# EAGLE design swimate (EAGLE 6.5.0)
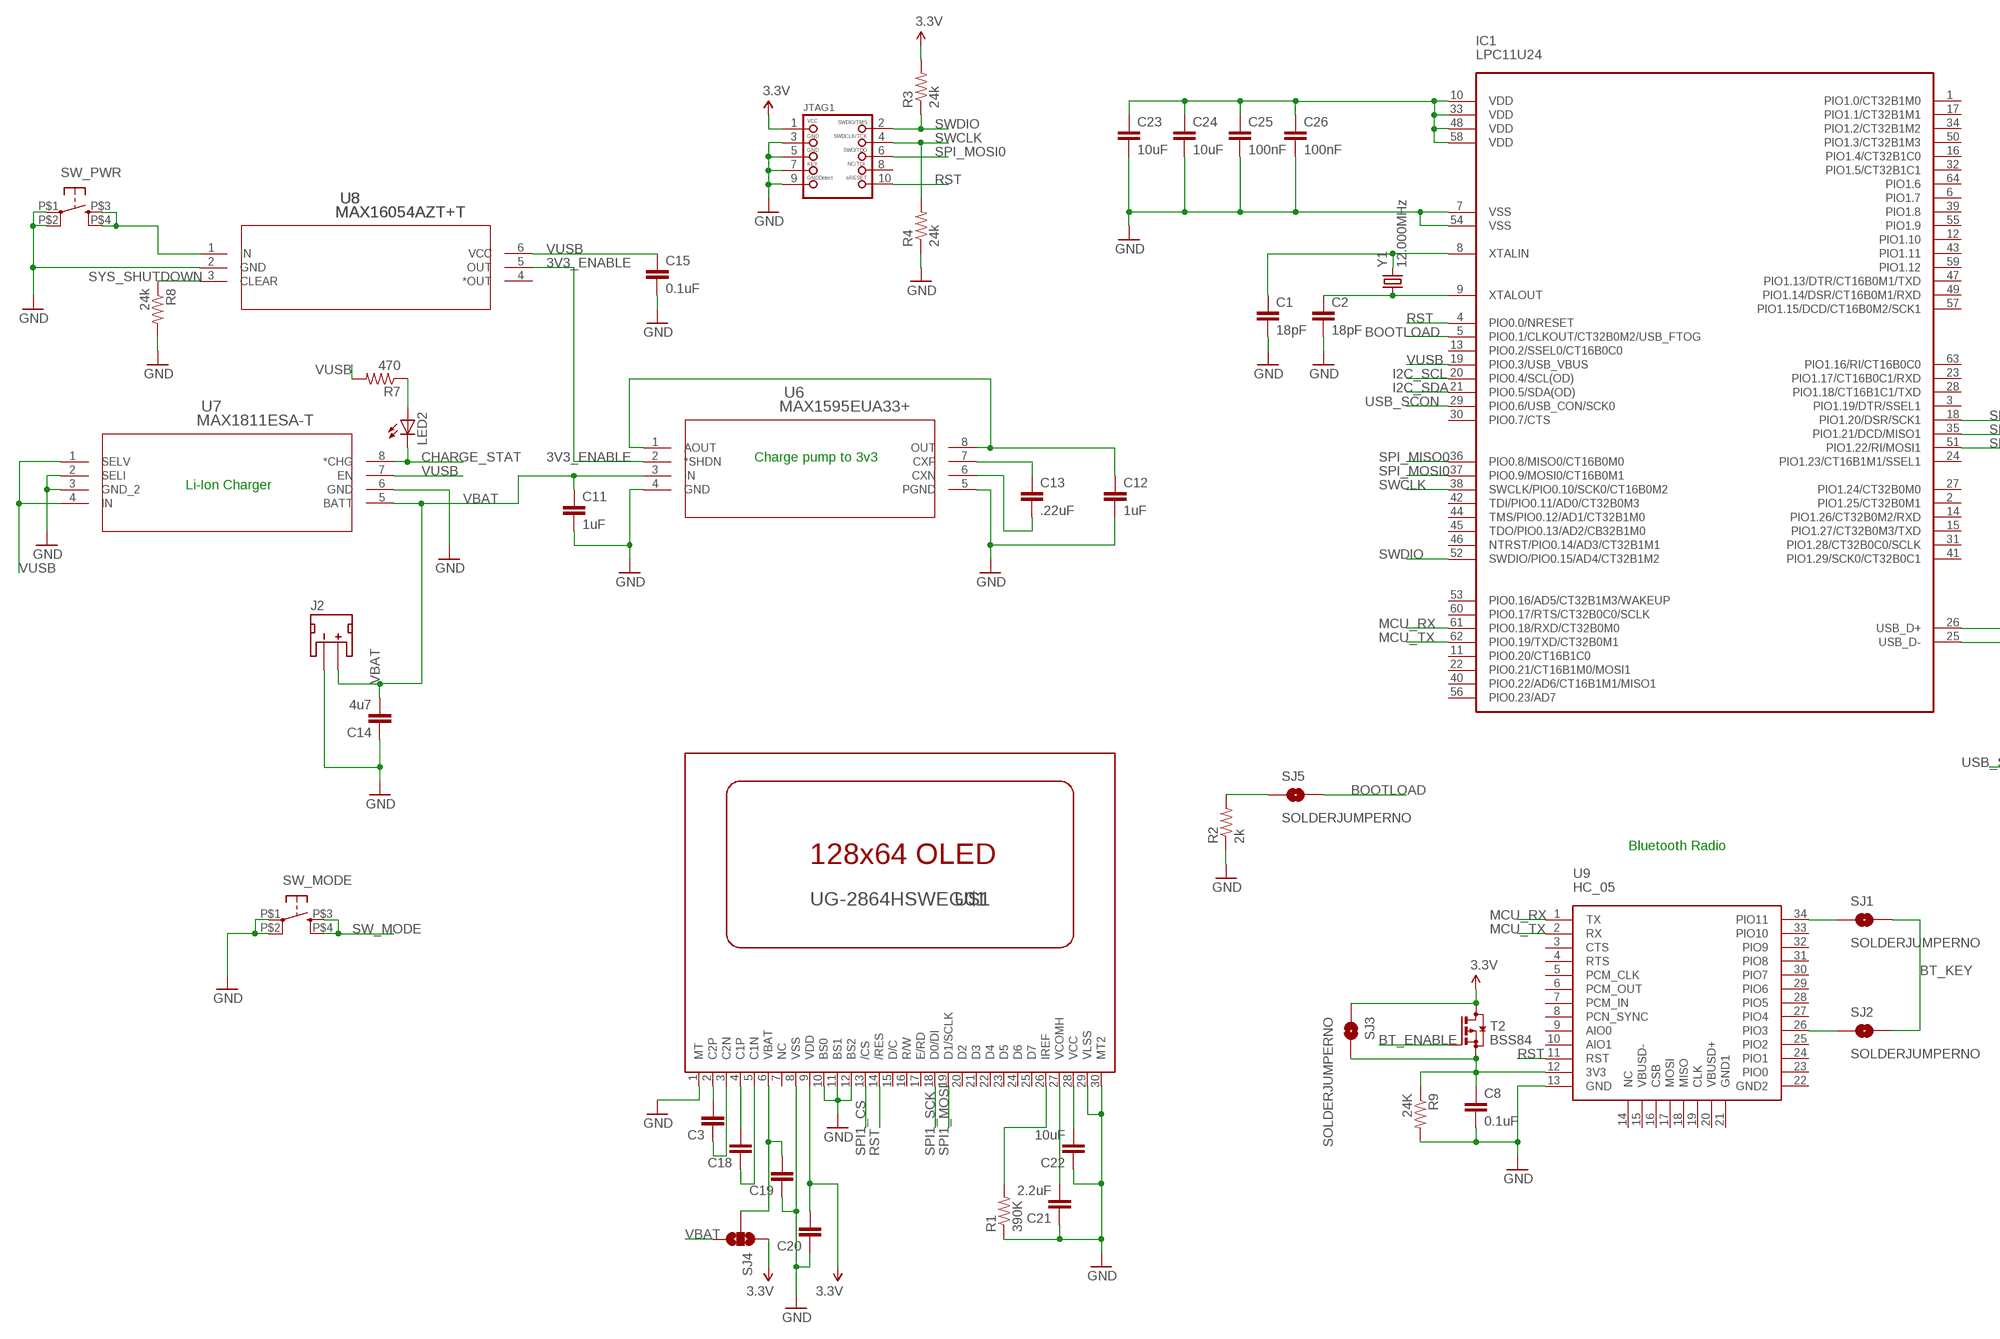
[diagram p0: schematic, sheet 1, part 1 of 2]
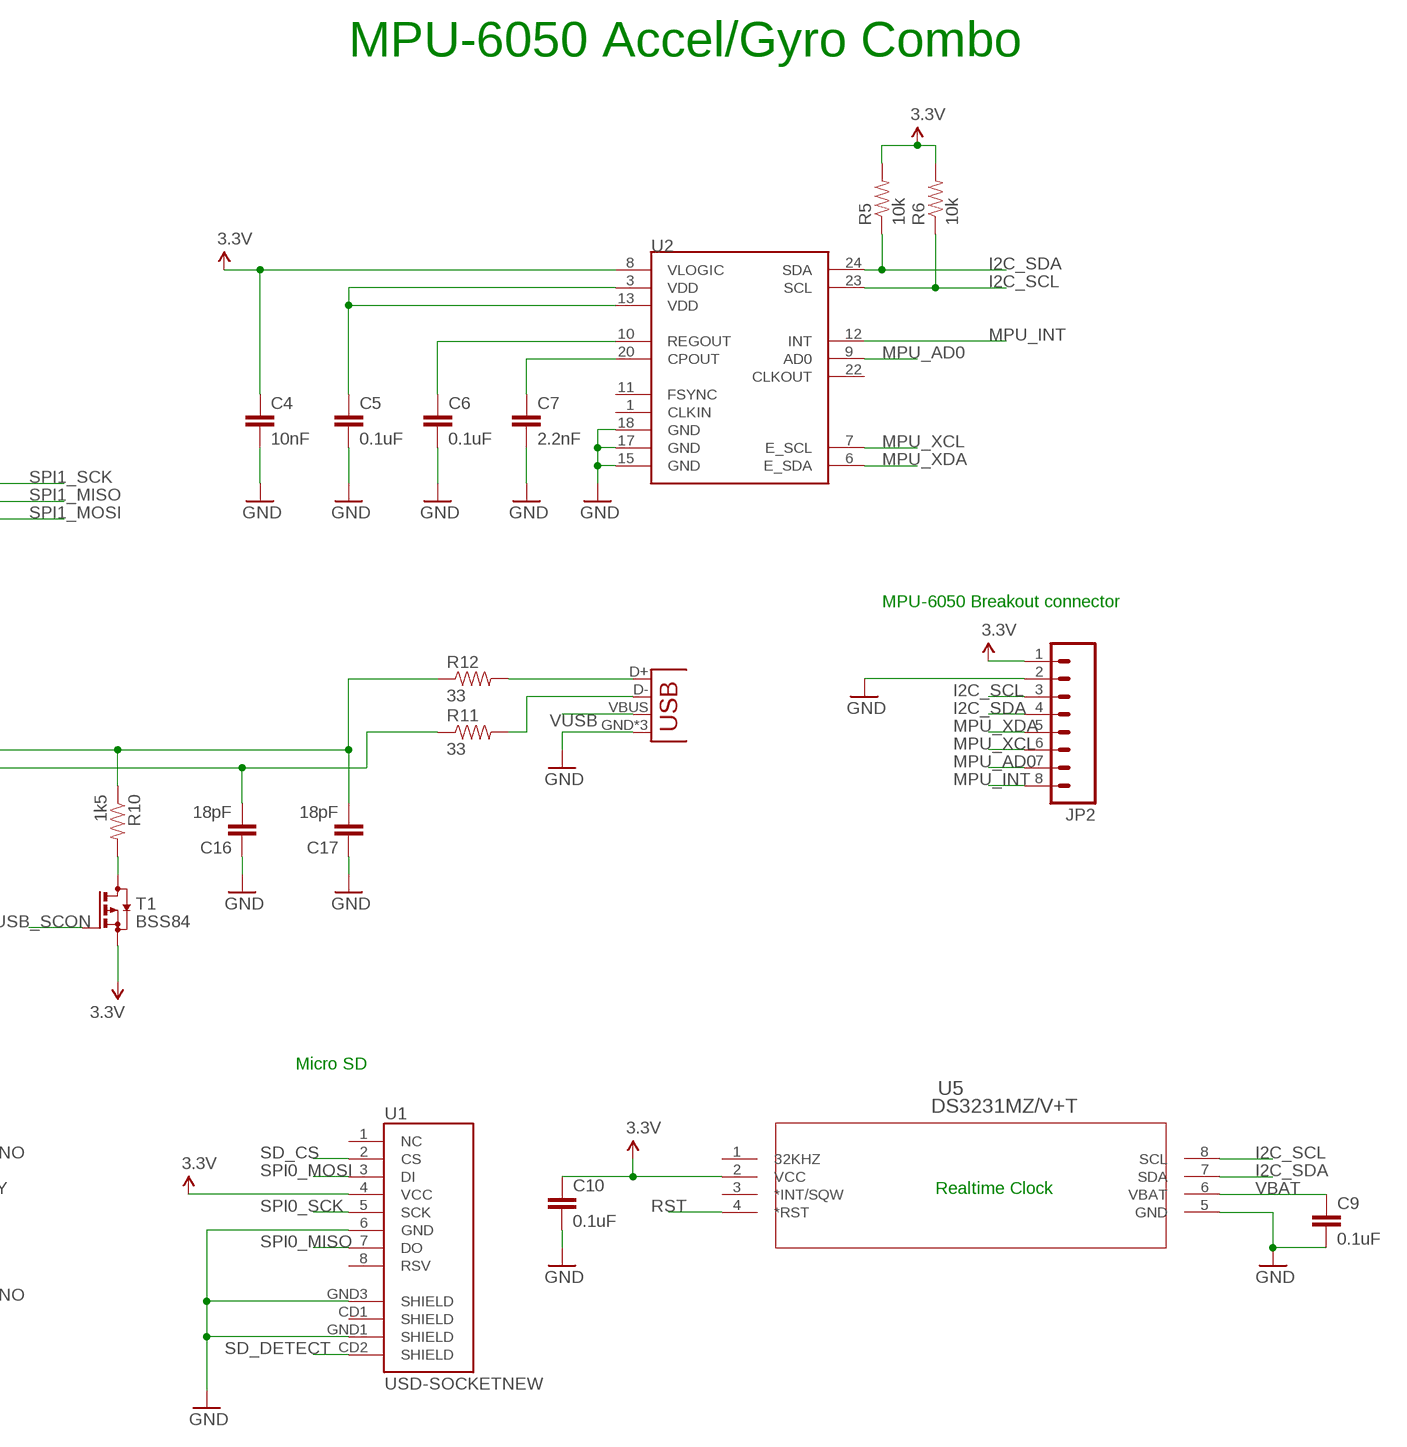
[diagram p1: schematic, sheet 1, part 2 of 2]

## Parts
C1  18pF  CAP0805  [0805]
C2  18pF  CAP0805  [0805]
C3  CAP0805  [0805]
C4  10nF  CAP0805  [0805]
C5  0.1uF  CAP0805  [0805]
C6  0.1uF  CAP0805  [0805]
C7  2.2nF  CAP0805  [0805]
C8  0.1uF  CAP0805  [0805]
C9  0.1uF  CAP0805  [0805]
C10  0.1uF  CAP0805  [0805]
C11  1uF  CAP1206  [1206]
C12  1uF  CAP1206  [1206]
C13  .22uF  CAP0805  [0805]
C14  4u7  CAP1206  [1206]
C15  0.1uF  CAP0805  [0805]
C16  18pF  CAP0805  [0805]
C17  18pF  CAP0805  [0805]
C18  CAP0805  [0805]
C19  CAP0805  [0805]
C20  CAP0805  [0805]
C21  2.2uF  CAP0805  [0805]
C22  10uF  CAP0805  [0805]
C23  10uF  CAP0805  [0805]
C24  10uF  CAP0805  [0805]
C25  100nF  CAP0805  [0805]
C26  100nF  CAP0805  [0805]
IC1  LPC11U24  [MBED-ICS_LQFP64]
J2  JST_2MM_MALE  [JST-2-SMD]
JP2  M08  [1X08_PIN1_NO_SILK]
JP3  USB-MICROB  [USB-MICROB]
JTAG1  JTAG-CORTEXM3  [2X05_1.27MM_SMT]
LED2  LED1206  [LED-1206]
R1  390K  RESISTOR0805-RES  [0805]
R2  2k  RESISTOR0805-RES  [0805]
R3  24k  RESISTOR0805-RES  [0805]
R4  24k  RESISTOR0805-RES  [0805]
R5  10k  RESISTOR0805-RES  [0805]
R6  10k  RESISTOR0805-RES  [0805]
R7  470  RESISTOR0805-RES  [0805]
R8  24k  RESISTOR0805-RES  [0805]
R9  24K  RESISTOR0805-RES  [0805]
R10  1k5  RESISTOR0805-RES  [0805]
R11  33  RESISTOR0805-RES  [0805]
R12  33  RESISTOR0805-RES  [0805]
SJ1  SOLDERJUMPERNO  [SJ_2S-NO]
SJ2  SOLDERJUMPERNO  [SJ_2S-NO]
SJ3  SOLDERJUMPERNO  [SJ_2S-NO]
SJ4  SOLDERJUMPER_2WAYS  [SJ_3]
SJ5  SOLDERJUMPERNO  [SJ_2S-NO]
SW_MODE  TAC_SWITCHKSA_SEALED  [KSA_SEALED_TAC_SWITCH]
SW_PWR  TAC_SWITCHKSA_SEALED  [KSA_SEALED_TAC_SWITCH]
T1  BSS84  [SOT23]
T2  BSS84  [SOT23]
U1  USD-SOCKETNEW  [MICRO-SD-SOCKET-PP]
U2  MPU-9150QFN-24-NP  [QFN-24-NP]
U5  DS3231MZ/V+T  [21-0041B_8]
U6  MAX1595EUA33+  [21-0036K]
U7  MAX1811ESA-T  [21-0041B_8]
U8  MAX16054AZT+T  [21-0114C]
U9  HC_05  [BLUETOOTH_SMD]
U$1  UG-2864HSWEG01  [1X30-0.7MM]
Y1  12.000MHz  CRYSTAL5X3  [CRYSTAL-SMD-5X3]

## Nets
3.3V: C4.1 C10.1 C20.2 JP2.1 JTAG1.1 R3.2 R5.2 R6.2 SJ3.1 SJ4.1 T1.2(S) T2.3(D) U1.4(VCC) U2.8(VLOGIC) U5.2(VCC) U$1.9(VDD)
3V3_ENABLE: U6.2(*SHDN) U8.5(OUT)
BOOTLOAD: IC1.5(PIO0.1/CLKOUT/CT32B0M2/USB_FTOG) SJ5.2
BT_ENABLE: T2.1(G)
BT_KEY: SJ1.2 SJ2.2
CHARGE_STAT: LED2.C U7.8(*CHG)
GND: C1.2 C2.2 C4.2 C5.2 C6.2 C7.2 C8.2 C9.2 C10.2 C11.2 C12.2 C14.1 C15.2 C16.1 C17.1 C19.1 C20.1 C21.1 C22.1 C23.2 C24.2 C25.2 C26.2 IC1.7(VSS) IC1.54(VSS) J2.1(-) JP2.2 JP3.GND JP3.MT1(GND) JP3.MT2(GND) JTAG1.3 JTAG1.5 JTAG1.7 JTAG1.9 R1.1 R2.1 R4.1 R8.2 R9.2 SW_MODE.P$1 SW_MODE.P$2 SW_PWR.P$1 SW_PWR.P$2 U1.6(GND) U1.GND1(SHIELD) U1.GND3(SHIELD) U2.15(GND) U2.17(GND) U2.18(GND) U5.5(GND) U6.4(GND) U6.5(PGND) U7.2(SELI) U7.3(GND_2) U7.6(GND) U8.2(GND) U9.13(GND) U$1.1(MT) U$1.8(VSS) U$1.10(BS0) U$1.11(BS1) U$1.12(BS2) U$1.29(VLSS) U$1.30(MT2)
I2C_SCL: IC1.20(PIO0.4/SCL(OD)) JP2.3 R6.1 U2.23(SCL) U5.8(SCL)
I2C_SDA: IC1.21(PIO0.5/SDA(OD)) JP2.4 R5.1 U2.24(SDA) U5.7(SDA)
MCU_RX: IC1.61(PIO0.18/RXD/CT32B0M0) U9.1(TX)
MCU_TX: IC1.62(PIO0.19/TXD/CT32B0M1) U9.2(RX)
MPU_AD0: JP2.7 U2.9(AD0)
MPU_INT: JP2.8 U2.12(INT)
MPU_XCL: JP2.6 U2.7(E_SCL)
MPU_XDA: JP2.5 U2.6(E_SDA)
N$1: SW_PWR.P$3 SW_PWR.P$4 U8.1(IN)
N$2: C18.1 U$1.5(C1N)
N$3: R1.2 U$1.26(IREF)
N$4: C5.1 U2.3(VDD) U2.13(VDD)
N$5: C6.1 U2.10(REGOUT)
N$6: C23.1 C24.1 C25.1 C26.1 IC1.10(VDD) IC1.33(VDD) IC1.48(VDD) IC1.58(VDD)
N$7: C7.1 U2.20(CPOUT)
N$8: LED2.A R7.1
N$9: SJ2.1 U9.26(PIO3)
N$11: SJ1.1 U9.34(PIO11)
N$12: C12.1 U6.1(AOUT) U6.8(OUT)
N$13: C13.1 U6.7(CXP)
N$14: C13.2 U6.6(CXN)
N$15: C8.1 R9.1 SJ3.2 T2.2(S) U9.12(3V3)
N$16: R10.2 T1.3(D)
N$17: C17.2 IC1.26(USB_D+) R10.1 R12.1
N$18: C16.2 IC1.25(USB_D-) R11.1
N$19: JP3.D+ R12.2
N$20: JP3.D- R11.2
N$21: R2.2 SJ5.1
N$23: C1.1 IC1.8(XTALIN) Y1.3
N$24: C2.1 IC1.9(XTALOUT) Y1.1
N$25: C3.2 U$1.2(C2P)
N$26: C22.2 U$1.28(VCC)
N$27: C3.1 U$1.3(C2N)
N$28: C21.2 U$1.27(VCOMH)
N$29: C18.2 U$1.4(C1P)
RST: IC1.4(PIO0.0/NRESET) JTAG1.10 U5.4(*RST) U9.11(RST) U$1.14(/RES)
SD_CS: U1.2(CS)
SD_DETECT: U1.CD2(SHIELD)
SPI0_MISO: U1.7(DO)
SPI0_MOSI: U1.3(DI)
SPI0_SCK: U1.5(SCK)
SPI1_CS: U$1.13(/CS)
SPI1_MISO: IC1.35(PIO1.21/DCD/MISO1)
SPI1_MOSI: IC1.51(PIO1.22/RI/MOSI1) U$1.19(D1/SCLK)
SPI1_SCK: IC1.18(PIO1.20/DSR/SCK1) U$1.18(D0/DI)
SPI_MISO0: IC1.36(PIO0.8/MISO0/CT16B0M0)
SPI_MOSI0: IC1.37(PIO0.9/MOSI0/CT16B0M1) JTAG1.6
SW_MODE: SW_MODE.P$3 SW_MODE.P$4
SWCLK: IC1.38(SWCLK/PIO0.10/SCK0/CT16B0M2) JTAG1.4 R4.2
SWDIO: IC1.52(SWDIO/PIO0.15/AD4/CT32B1M2) JTAG1.2 R3.1
SYS_SHUTDOWN: R8.1 U8.3(CLEAR)
USB_SCON: IC1.29(PIO0.6/USB_CON/SCK0) T1.1(G)
VBAT: C9.1 C11.1 C14.2 J2.2(+) SJ4.3 U5.6(VBAT) U6.3(IN) U7.5(BATT)
VDISPLAY: C19.2 SJ4.2 U$1.6(VBAT)
VUSB: C15.1 IC1.19(PIO0.3/USB_VBUS) JP3.VBUS R7.2 U7.1(SELV) U7.4(IN) U7.7(EN) U8.6(VCC)
Unconnected: IC1.1(PIO1.0/CT32B1M0) IC1.2(PIO1.25/CT32B0M1) IC1.3(PIO1.19/DTR/SSEL1) IC1.6(PIO1.7) IC1.11(PIO0.20/CT16B1C0) IC1.12(PIO1.10) IC1.13(PIO0.2/SSEL0/CT16B0C0) IC1.14(PIO1.26/CT32B0M2/RXD) IC1.15(PIO1.27/CT32B0M3/TXD) IC1.16(PIO1.4/CT32B1C0) IC1.17(PIO1.1/CT32B1M1) IC1.22(PIO0.21/CT16B1M0/MOSI1) IC1.23(PIO1.17/CT16B0C1/RXD) IC1.24(PIO1.23/CT16B1M1/SSEL1) IC1.27(PIO1.24/CT32B0M0) IC1.28(PIO1.18/CT16B1C1/TXD) IC1.30(PIO0.7/CTS) IC1.31(PIO1.28/CT32B0C0/SCLK) IC1.32(PIO1.5/CT32B1C1) IC1.34(PIO1.2/CT32B1M2) IC1.39(PIO1.8) IC1.40(PIO0.22/AD6/CT16B1M1/MISO1) IC1.41(PIO1.29/SCK0/CT32B0C1) IC1.42(TDI/PIO0.11/AD0/CT32B0M3) IC1.43(PIO1.11) IC1.44(TMS/PIO0.12/AD1/CT32B1M0) IC1.45(TDO/PIO0.13/AD2/CB32B1M0) IC1.46(NTRST/PIO0.14/AD3/CT32B1M1) IC1.47(PIO1.13/DTR/CT16B0M1/TXD) IC1.49(PIO1.14/DSR/CT16B0M1/RXD) IC1.50(PIO1.3/CT32B1M3) IC1.53(PIO0.16/AD5/CT32B1M3/WAKEUP) IC1.55(PIO1.9) IC1.56(PIO0.23/AD7) IC1.57(PIO1.15/DCD/CT16B0M2/SCK1) IC1.59(PIO1.12) IC1.60(PIO0.17/RTS/CT32B0C0/SCLK) IC1.63(PIO1.16/RI/CT16B0C0) IC1.64(PIO1.6) J2.NC1(PAD1) J2.NC2(PAD2) JTAG1.8 U1.1(NC) U1.8(RSV) U1.CD1(SHIELD) U2.1(CLKIN) U2.11(FSYNC) U2.22(CLKOUT) U5.1(32KHZ) U5.3(*INT/SQW) U8.4(*OUT) U9.3(CTS) U9.4(RTS) U9.5(PCM_CLK) U9.6(PCM_OUT) U9.7(PCM_IN) U9.8(PCN_SYNC) U9.9(AIO0) U9.10(AIO1) U9.14(NC) U9.15(VBUSD-) U9.16(CSB) U9.17(MOSI) U9.18(MISO) U9.19(CLK) U9.20(VBUSD+) U9.21(GND1) U9.22(GND2) U9.23(PIO0) U9.24(PIO1) U9.25(PIO2) U9.27(PIO4) U9.28(PIO5) U9.29(PIO6) U9.30(PIO7) U9.31(PIO8) U9.32(PIO9) U9.33(PIO10) U$1.7(NC) U$1.15(D/C) U$1.16(R/W) U$1.17(E/RD) U$1.20(D2) U$1.21(D3) U$1.22(D4) U$1.23(D5) U$1.24(D6) U$1.25(D7)

## Notes on the sheet
- MPU-6050 Accel/Gyro Combo
- Charge pump to 3v3
- Li-Ion Charger
- MPU-6050 Breakout connector
- Bluetooth Radio
- Micro SD
- Realtime Clock

## Library data of the parts
C1 C2 C4-C10 C13-C17 = SparkFun-Passives:CAP: Capacitor Standard 0603 ceramic capacitor, and 0.1" leaded capacitor.
C3 C11 C12 C18-C26 = SparkFun-Capacitors:CAP: Capacitor Standard 0603 ceramic capacitor, and 0.1" leaded capacitor.
IC1 = mbed-HDK:LPC11U24: NXP Cortex-M0 Micrcontroller
J2 = SparkFun-Connectors:JST_2MM_MALE: Mates to single-cell LiPo batteries. CONN-08352; PROD_ID: CONN-08352
JP2 = SparkFun-Connectors:M08: Header 8 Standard 8-pin 0.1" header. Use with straight break away headers (SKU : PRT-00116), right angle break away headers (PRT-00553), swiss pins (PRT-00743), machine pins (PRT-00117), and female headers (PRT-00115).
JP3 = SparkFun-Connectors:USB: USB Connectors USB-B-PTH is fully proven SKU : PRT-00139/CONN-08278 USB-miniB is fully proven SKU : PRT-00587 USB-A-PCB is untested. USB-A-H is throughly reviewed, but untested. Spark Fun Electronics SKU : PRT-00437 USB-B-SMT is throughly reviewed, but untested. Needs silkscreen touching up. USB-A-S has not been used/tested USB-MB-H has not been used/tested USB-MICROB has been used. CONN-09505; PROD_ID: CONN-09505
JTAG1 = microbuilder:JTAG-CORTEXM3: Serial Wire (SW-DP) Connector This standard 0.05" 10-pin connector is for use with the Cortex M0/M3's native SWD (serial wire debugger) interface (SW-DP). Some boards support a 20-pin combined JTAG+SWD connector (SWJ-DP), such as the LPC1700 family, but many smaller devices only work with SWD which typically use the smaller 10-pin SW-DP connecter (the LPC1300 family, for example, only supports SWD). 2x05 1.27mm/0.05" Connector: This is the standard SMT connector defined by ARM for all Cortex devices, and should be used in most situations and for forward-compatibility since any new devices coming to market will likely use this connector. MOLEX 10 Pin 0.1" Connector: This 0.1" 10 pin connector has the same pin layout as the standard 0.05" connector, but is easier to work with if you are using standard jumper wires or custom cables to connect your SWD hardware. MOLEX 20 Pin 0.1" Connector: This 0.1" 20 pin connector is the same model used for ARM7/ARM9 JTAG debuggers, but is connected to match the pins on the Segger J-Link for ARM (which supports both JTAG and SWD debugging). See the following document from ARM for more information on Cortex M3 Debug Connectors: http://infocenter.arm.com/help/topic/com.arm.doc.faqs/attached/13634/cortex_debug_connectors.pdf And the following page for an overview with images of the different connector types: http://www.keil.com/peripherals/coresight/connectors.asp
LED2 = SparkFun-LED:LED: LEDs Standard schematic elements and footprints for 5mm, 3mm, 1206, and 0603 sized LEDs. 5mm - Spark Fun Electronics SKU : COM-00529 (and others)
R1-R12 = SparkFun-Passives:RESISTOR: Resistor Basic schematic elements and footprints for 0603, 1206, and PTH resistors.
SJ1-SJ3 SJ5 = SparkFun-Passives:SOLDERJUMPER: Solder Jumper Standard SMD solder jumper. Used to automate production. Two varients : Normally Open and Normally Closed are the same, but have different paste layers. NC will have a large amount of paste and should jumper during reflow.
SJ4 = SparkFun-Passives:SOLDERJUMPER_2WAY: Solder Jumper 2 way solder jumper
SW_MODE SW_PWR = SparkFun-Electromechanical:TAC_SWITCH: Momentary Switch Button commonly used for reset or general input. Spark Fun Electronics SKU : COM-00097 SMT- SWCH-08247
T1 T2 = mbed-HDK:BSS84: P-CHANNEL MOS FET
U1 = SparkFun-Connectors:USD-SOCKET: microSD Socket Push-push type uSD socket. Schematic element and footprint production proven. Spark Fun Electronics SKU : PRT-00127. tDoc lines correctly indicate media card edge positions when inserting (unlocked, locked, depressed).
U2 = SparkFun-Sensors:MPU-9150: 9DOF (3mag, 3accel, 3rotat). I2C interface.
U5 = maximparts:DS3231MZ/V+T; MANUFACTURER_NAME: Maxim; MANUFACTURER_PART_NUMBER: DS3231MZ/V+T; VENDOR: Maxim
U6 = maximparts:MAX1595EUA33+; MANUFACTURER_NAME: Maxim; MANUFACTURER_PART_NUMBER: MAX1595EUA33+; VENDOR: Maxim
U7 = maximparts:MAX1811ESA-T; MANUFACTURER_NAME: Maxim; MANUFACTURER_PART_NUMBER: MAX1811ESA-T; VENDOR: Maxim
U8 = maximparts:MAX16054AZT+T; MANUFACTURER_NAME: Maxim; MANUFACTURER_PART_NUMBER: MAX16054AZT+T; VENDOR: Maxim
U9 = Bluetooth HC-05:HC_05: HC-05 Bluetooth Module
U$1 = adafruit:UG-2864HSWEG01: UG-2864HSWEG01 OLED display
Y1 = SparkFun-FreqCtrl:CRYSTAL: Various standard crystals. Proven footprints. Spark Fun Electronics SKU : COM-00534

## Board
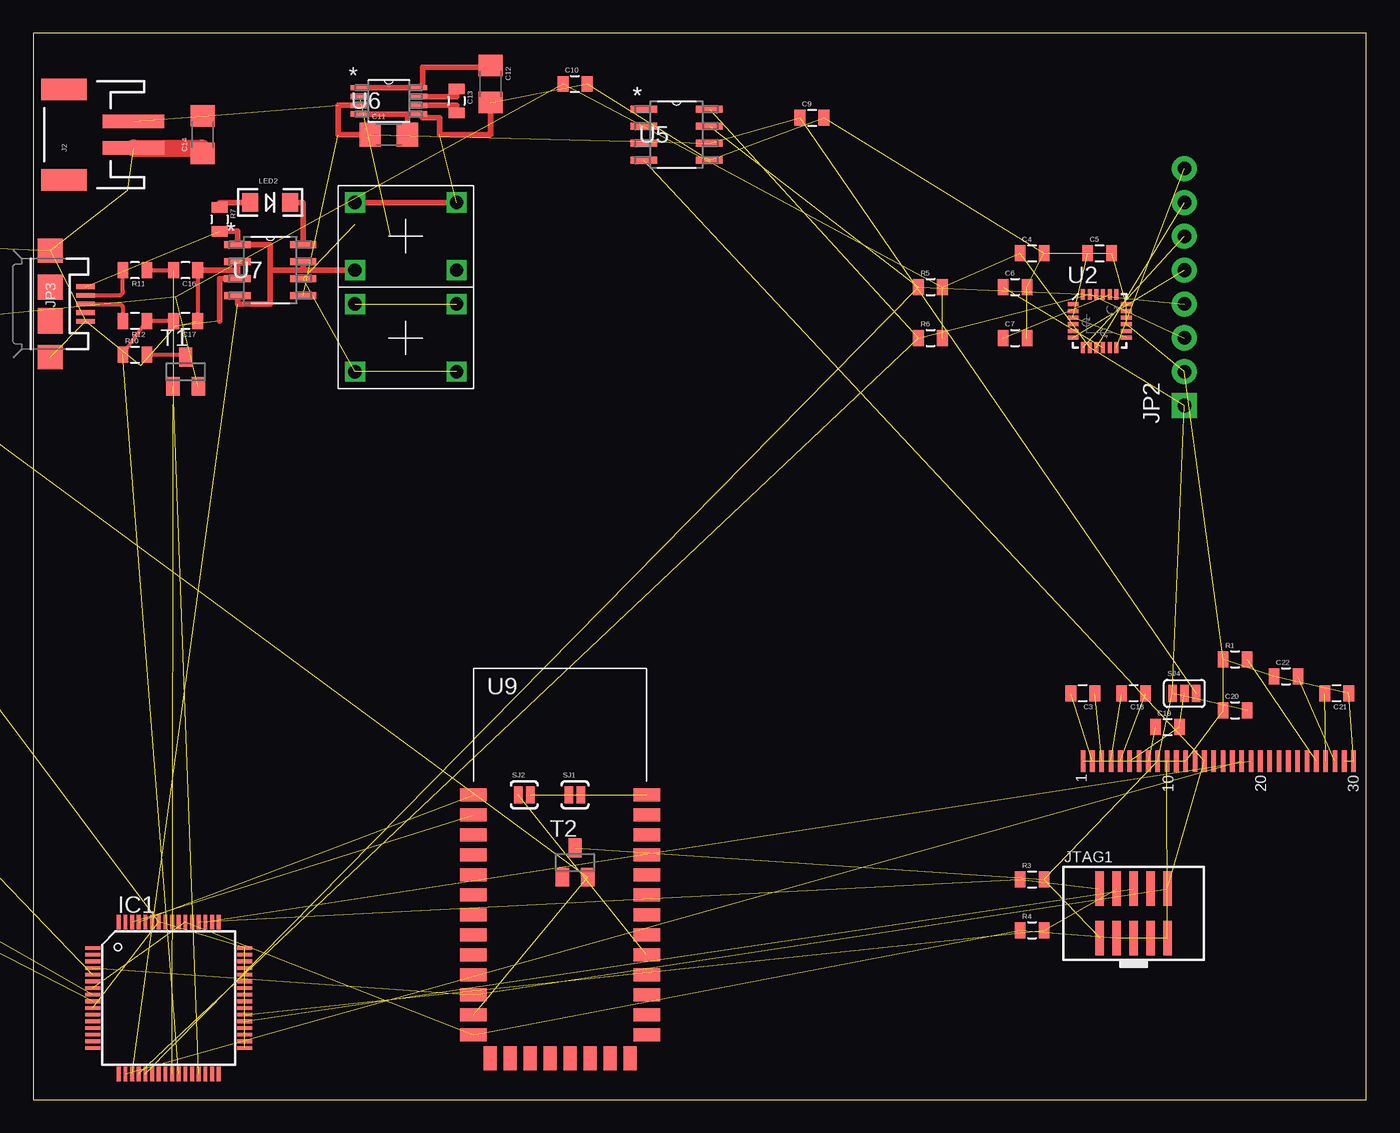
[diagram p2: board, top side]
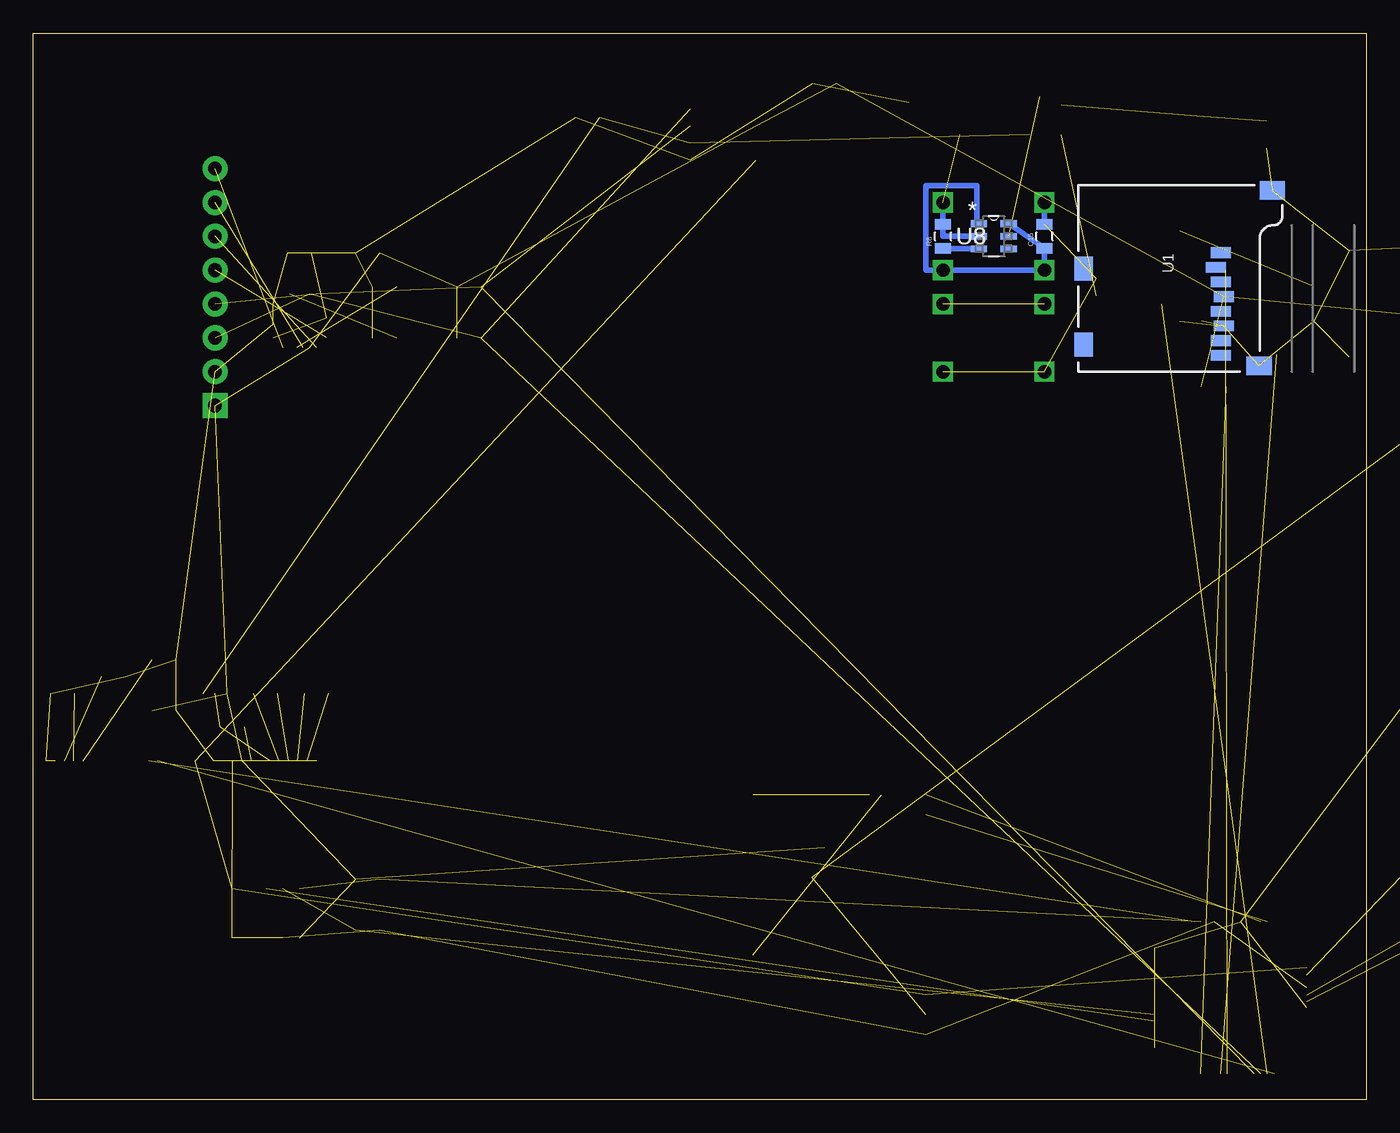
[diagram p3: board, bottom side, seen from below]

Size 100 x 80 mm. Coordinates in mm from the lower left corner, seen from the top.
Outline: 0,0 100,0 100,80 0,80 0,0
Copper layers (1*16): Top 0.035mm / dielectric 1.5mm / Bottom 0.035mm
Design rules "default": minimum track width 10mil, minimum drill 24mil, track to track 8mil, track to pad 8mil, pad to pad 8mil, via to via 8mil, smd to smd 8mil, copper to edge 40mil, drill to drill 8mil, minimum pad ring 10mil, minimum via ring 8mil, stop-mask expansion 4mil, vias tented up to drill 0mil, thermal gap 10mil

### Footprints (pad centres in the part's own frame; a part is rotated, then mirrored left to right if it is on the bottom)
0805 = smd 0.8 x 1.2: 1 -0.9,0; 2 0.9,0
1206 = smd 1.6 x 1.8: 1 -1.4,0; 2 1.4,0
MBED-ICS_LQFP64 = smd 1.1 x 0.285: 1 -5.7,3.75; 2 -5.7,3.25; 3 -5.7,2.75; 4 -5.7,2.25; 5 -5.7,1.75; 6 -5.7,1.25; 7 -5.7,0.75; 8 -5.7,0.25; 9 -5.7,-0.25; 10 -5.7,-0.75; 11 -5.7,-1.25; 12 -5.7,-1.75; 13 -5.7,-2.25; 14 -5.7,-2.75; 15 -5.7,-3.25; 16 -5.7,-3.75; 33 5.7,-3.75; 34 5.7,-3.25; 35 5.7,-2.75; 36 5.7,-2.25; 37 5.7,-1.75; 38 5.7,-1.25; 39 5.7,-0.75; 40 5.7,-0.25; 41 5.7,0.25; 42 5.7,0.75; 43 5.7,1.25; 44 5.7,1.75; 45 5.7,2.25; 46 5.7,2.75; 47 5.7,3.25; 48 5.7,3.75 | smd 0.285 x 1.1: 17 -3.75,-5.7; 18 -3.25,-5.7; 19 -2.75,-5.7; 20 -2.25,-5.7; 21 -1.75,-5.7; 22 -1.25,-5.7; 23 -0.75,-5.7; 24 -0.25,-5.7; 25 0.25,-5.7; 26 0.75,-5.7; 27 1.25,-5.7; 28 1.75,-5.7; 29 2.25,-5.7; 30 2.75,-5.7; 31 3.25,-5.7; 32 3.75,-5.7; 49 3.75,5.7; 50 3.25,5.7; 51 2.75,5.7; 52 2.25,5.7; 53 1.75,5.7; 54 1.25,5.7; 55 0.75,5.7; 56 0.25,5.7; 57 -0.25,5.7; 58 -0.75,5.7; 59 -1.25,5.7; 60 -1.75,5.7; 61 -2.25,5.7; 62 -2.75,5.7; 63 -3.25,5.7; 64 -3.75,5.7
JST-2-SMD = smd 1 x 4.6: 1 -1,-3.7; 2 1,-3.7 | smd 1.6 x 3.4: NC1 -3.4,1.5; NC2 3.4,1.5
1X08_PIN1_NO_SILK = drill 1.016 pad 1.88 square: 1 0,0 | drill 1.016 pad 1.88: 2 2.54,0; 3 5.08,0; 4 7.62,0; 5 10.16,0; 6 12.7,0; 7 15.24,0; 8 17.78,0
USB-MICROB = smd 0.35 x 1.4: D+ 0,2.65; D- -0.65,2.65; GND 1.3,2.65; ID 0.65,2.65; VBUS -1.3,2.65 | smd 1.8 x 1.9: MT1 -4,0; MT2 4,0 | smd 1.9 x 1.9: P$1 -1.27,0; P$2 1.27,0
2X05_1.27MM_SMT = smd 0.65 x 2.6: 1 -2.54,-1.85; 2 -2.54,1.85; 3 -1.27,-1.85; 4 -1.27,1.85; 5 0,-1.85; 6 0,1.85; 7 1.27,-1.85; 8 1.27,1.85; 9 2.54,-1.85; 10 2.54,1.85
LED-1206 = smd 1.2 x 1.4: A -1.5,0; C 1.5,0
SJ_2S-NO = smd 0.635 x 1.27: 1 -0.45,0; 2 0.45,0
SJ_3 = smd 0.635 x 1.27: 1 -0.889,0; 2 0,0; 3 0.889,0
KSA_SEALED_TAC_SWITCH = drill 1 square: P$1 -3.81,2.54; P$2 3.81,2.54; P$3 -3.81,-2.54; P$4 3.81,-2.54
SOT23 = smd 1 x 1.4: 1 -0.95,-1.1; 2 0.95,-1.1; 3 0,1.1
MICRO-SD-SOCKET-PP = smd 0.8 x 1.5: 1 -8.94,10.7; 2 -7.84,10.3; 3 -6.74,10.7; 4 -5.64,10.9; 5 -4.54,10.7; 6 -3.44,10.9; 7 -2.34,10.7; 8 -1.24,10.7 | smd 1.8 x 1.4: CD1 -2.05,0.4; CD2 -7.75,0.4 | smd 1.4 x 1.9: GND1 -13.6,14.55; GND3 -0.45,13.55
QFN-24-NP = smd 0.8 x 0.3: 1 -2,1.25; 2 -2,0.75; 3 -2,0.25; 4 -2,-0.25; 5 -2,-0.75; 6 -2,-1.25; 13 2,-1.25; 14 2,-0.75; 15 2,-0.25; 16 2,0.25; 17 2,0.75; 18 2,1.25 | smd 0.3 x 0.8: 7 -1.25,-2; 8 -0.75,-2; 9 -0.25,-2; 10 0.25,-2; 11 0.75,-2; 12 1.25,-2; 19 1.25,2; 20 0.75,2; 21 0.25,2; 22 -0.25,2; 23 -0.75,2; 24 -1.25,2
21-0041B_8 = smd 1.981 x 0.533: 1 -2.464,1.905; 2 -2.464,0.635; 3 -2.464,-0.635; 4 -2.464,-1.905; 5 2.464,-1.905; 6 2.464,-0.635; 7 2.464,0.635; 8 2.464,1.905
21-0036K = smd 1.372 x 0.406: 1 -2.184,0.991; 2 -2.184,0.33; 3 -2.184,-0.33; 4 -2.184,-0.991; 5 2.184,-0.991; 6 2.184,-0.33; 7 2.184,0.33; 8 2.184,0.991
21-0114C = smd 1.219 x 0.508: 1 -1.118,0.94; 2 -1.118,0; 3 -1.118,-0.94; 4 1.118,-0.94; 5 1.118,0; 6 1.118,0.94
BLUETOOTH_SMD = smd 2 x 1: 1 -6.35,3.81; 2 -6.35,2.31; 3 -6.35,0.81; 4 -6.35,-0.69; 5 -6.35,-2.19; 6 -6.35,-3.69; 7 -6.35,-5.19; 8 -6.35,-6.69; 9 -6.35,-8.19; 10 -6.35,-9.69; 11 -6.35,-11.19; 12 -6.35,-12.69; 13 -6.35,-14.19; 22 6.65,-14.19; 23 6.65,-12.69; 24 6.65,-11.19; 25 6.65,-9.69; 26 6.65,-8.19; 27 6.65,-6.69; 28 6.65,-5.19; 29 6.65,-3.69; 30 6.65,-2.19; 31 6.65,-0.69; 32 6.65,0.81; 33 6.65,2.31; 34 6.65,3.81 | smd 1 x 1.8: 14 -5.1,-15.94; 15 -3.6,-15.94; 16 -2.1,-15.94; 17 -0.6,-15.94; 18 0.9,-15.94; 19 2.4,-15.94; 20 3.9,-15.94; 21 5.4,-15.94
1X30-0.7MM = smd 0.35 x 1.6: 1 -10.15,0; 2 -9.45,0; 3 -8.75,0; 4 -8.05,0; 5 -7.35,0; 6 -6.65,0; 7 -5.95,0; 8 -5.25,0; 9 -4.55,0; 10 -3.85,0; 11 -3.15,0; 12 -2.45,0; 13 -1.75,0; 14 -1.05,0; 15 -0.35,0; 16 0.35,0; 17 1.05,0; 18 1.75,0; 19 2.45,0; 20 3.15,0; 21 3.85,0; 22 4.55,0; 23 5.25,0; 24 5.95,0; 25 6.65,0; 26 7.35,0; 27 8.05,0; 28 8.75,0; 29 9.45,0; 30 10.15,0
CRYSTAL-SMD-5X3 = smd 1.9 x 1.1: 1 -1.85,-1.15; 2 1.85,-1.15; 3 1.85,1.15; 4 -1.85,1.15

### Placement (x,y rotation side)
C1  -55.88,59.69 0 top  (outside the outline)
C2  -59.69,59.69 0 top  (outside the outline)
C3  78.74,30.48 180 top
C4  74.93,63.5 0 top
C5  80.01,63.5 0 top
C6  73.66,60.96 0 top
C7  73.66,57.15 0 top
C8  -22.86,64.77 0 top  (outside the outline)
C9  58.42,73.66 0 top
C10  40.64,76.2 0 top
C11  26.67,72.39 0 top
C12  34.29,76.2 270 top
C13  31.75,74.93 270 top
C14  12.7,72.39 90 top
C15  24.13,64.77 90 bottom
C16  11.43,62.23 180 top
C17  11.43,58.42 180 top
C18  82.55,30.48 180 top
C19  85.09,27.94 0 top
C20  90.17,29.21 0 top
C21  97.79,30.48 180 top
C22  93.98,31.75 0 top
C23  -25.4,60.96 0 top  (outside the outline)
C24  -30.48,60.96 0 top  (outside the outline)
C25  -35.56,60.96 0 top  (outside the outline)
C26  -40.64,60.96 0 top  (outside the outline)
IC1  10.16,7.62 0 top
J2  3.81,72.39 90 top
JP2  86.36,52.07 90 top
JP3  1.27,59.69 270 top
JTAG1  82.55,13.97 0 top
LED2  17.78,67.31 0 top
R1  90.17,33.02 0 top
R2  -60.96,64.77 0 top  (outside the outline)
R3  74.93,16.51 0 top
R4  74.93,12.7 0 top
R5  67.31,60.96 0 top
R6  67.31,57.15 0 top
R7  13.97,66.04 270 top
R8  31.75,64.77 90 bottom
R9  -26.67,68.58 0 top  (outside the outline)
R10  7.62,55.88 0 top
R11  7.62,62.23 180 top
R12  7.62,58.42 180 top
SJ1  40.64,22.86 0 top
SJ2  36.83,22.86 0 top
SJ3  -33.02,55.88 0 top  (outside the outline)
SJ4  86.36,30.48 0 top
SJ5  -40.64,55.88 0 top  (outside the outline)
SW_MODE  27.94,57.15 180 top
SW_PWR  27.94,64.77 0 top
T1  11.43,54.61 0 top
T2  40.64,17.78 0 top
U1  21.59,54.61 270 bottom
U2  80.01,58.42 0 top
U5  48.26,72.39 0 top
U6  26.67,74.93 0 top
U7  17.78,62.23 0 top
U8  27.94,64.77 0 bottom
U9  39.37,19.05 0 top
U$1  88.9,25.4 0 top
Y1  -63.5,44.45 0 top  (outside the outline)

### Tracks (layer width: path | path; a pad name or v marks a point on that pad's centre or on a via)
3.3V  (15 unrouted)
3V3_ENABLE  (1 unrouted)
BOOTLOAD  (1 unrouted)
BT_KEY  (1 unrouted)
CHARGE_STAT
  Top 0.406: LED2.C 20.24,67.31 U7.8
GND  (52 unrouted)
  Top 0.305: C16.1 C17.1
  Top 0.406: 28.07,73.94 U6.4 | 28.07,73.94 U6.5 29.21,73.94 29.21,73.66 30.48,73.66 30.48,72.39 34.29,72.39 C12.2 | 28.07,73.94 C11.2 | SW_PWR.P$2 SW_PWR.P$1 | C16.1 15.32,62.23 | 15.32,62.23 U7.2 | 15.32,62.23 U7.3 13.97,61.59 13.97,58.42
  Top 1.27: J2.1 12.63,71.39 arc-90 12.7,71.32 C14.1
  Bottom 0.406: C15.2 SW_PWR.P$1 | U8.2 31.75,64.77 R8.2 SW_PWR.P$2
I2C_SCL  (4 unrouted)
I2C_SDA  (4 unrouted)
MCU_RX  (1 unrouted)
MCU_TX  (1 unrouted)
MPU_AD0  (1 unrouted)
MPU_INT  (1 unrouted)
MPU_XCL  (1 unrouted)
MPU_XDA  (1 unrouted)
N$1
  Bottom 0.406: U8.1 29.21,65.71 29.21,68.58 33.02,68.58 33.02,62.23 SW_PWR.P$4 SW_PWR.P$3
N$2  (1 unrouted)
N$3  (1 unrouted)
N$4  (2 unrouted)
N$5  (1 unrouted)
N$6  (7 unrouted)
N$7  (1 unrouted)
N$8
  Top 0.406: LED2.A 13.97,67.31 R7.1
N$9  (1 unrouted)
N$11  (1 unrouted)
N$12
  Top 0.406: U6.1 U6.8 29.21,75.92 29.21,77.47 34.29,77.47 C12.1
N$13
  Top 0.406: U6.7 31.75,75.26 C13.1
N$14
  Top 0.406: U6.6 31.75,74.6 C13.2
N$15  (4 unrouted)
N$16
  Top 0.305: R10.2 11.26,55.88 arc-90 T1.3
N$17  (1 unrouted)
  Top 0.305: C17.2 R12.1 R10.1
N$18  (1 unrouted)
  Top 0.305: R11.1 C16.2
N$19
  Top 0.305: JP3.D+ 6.4,59.69 arc-90 6.72,59.37 R12.2
N$20
  Top 0.305: JP3.D- 6.4,60.34 arc90 6.72,60.66 R11.2
N$21  (1 unrouted)
N$23  (2 unrouted)
N$24  (2 unrouted)
N$25  (1 unrouted)
N$26  (1 unrouted)
N$27  (1 unrouted)
N$28  (1 unrouted)
N$29  (1 unrouted)
RST  (4 unrouted)
SPI1_MOSI  (1 unrouted)
SPI1_SCK  (1 unrouted)
SPI_MOSI0  (1 unrouted)
SW_MODE  (1 unrouted)
SWCLK  (2 unrouted)
SWDIO  (2 unrouted)
SYS_SHUTDOWN
  Bottom 0.406: U8.3 31.75,63.83 R8.1
USB_SCON  (1 unrouted)
VBAT  (6 unrouted)
  Top 0.406: C11.1 22.86,72.39 22.86,74.6 U6.3
VDISPLAY  (2 unrouted)
VUSB  (via drill 0.6)  (2 unrouted)
  Top 0.406: R7.2 15.32,65.14 U7.1 17.78,64.14 17.78,62.23 | 20.24,62.23 U7.7 | 20.24,62.23 17.78,62.23 | 17.78,62.23 17.78,59.69 15.32,59.69 U7.4 | v24.13,62.23 20.24,62.23
  Bottom 0.406: v24.13,62.23 C15.1 U8.6